# Altium schematic sheet [6] QSPI.SchDoc
size A4
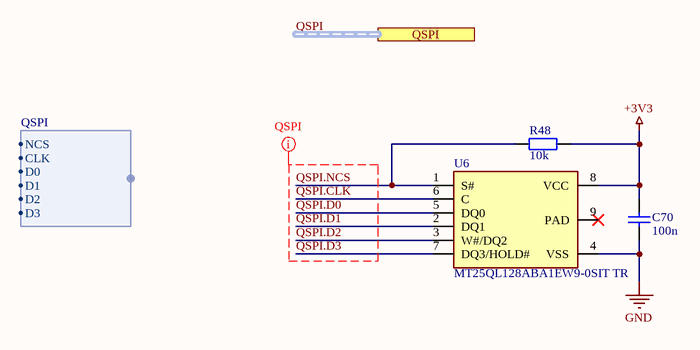
[diagram p0: [6] QSPI.SchDoc]

## Parts
C70  100n  [Capacitor 0603]
R48  10k  [Resistor 0603]
U6  MT25QL128ABA1EW9-0SIT TR  [WDFN8]

## Ports
QSPI (harness QSPI)

## Harnesses
QSPI: CLK, NCS, D0, D2, D3, D1

## Nets
+3V3: C70.2 R48.2 U6.8(VCC)
GND: C70.1 U6.4(VSS)
QSPI.CLK: U6.6(C)
QSPI.D0: U6.5(DQ0)
QSPI.D1: U6.2(DQ1)
QSPI.D2: U6.3(W#/DQ2)
QSPI.D3: U6.7(DQ3/HOLD#)
QSPI.NCS: R48.1 U6.1(S#)

Not connected (* = marked no-connect by the designer): U6 9(PAD)*

## Buses and harness runs
harness QSPI = port QSPI

## Layout directives
net class QSPI: QSPI.CLK, QSPI.D0, QSPI.D1, QSPI.D2, QSPI.D3, QSPI.NCS

## Library data of the parts
C70 = Capacitor 100n 10% 0603 EMK107B7104KA-T: Multilayer Ceramic Capacitors MLCC - SMD/SMT 0603 16VDC 0.1uF 10% X7R; Manufacturer: Taiyo Yuden; Type: SMD; Manufacturer Part Number: EMK107B7104KA-T; Footprint: 0603; Datasheet: https://pl.mouser.com/datasheet/2/396/mlcc02_e-1307760.pdf
R48 = Resistor 10k 1% 0603 RT0603FRE0710KL: Thin Film Resistors - SMD 10K ohm 1% 1/10W; Manufacturer: Yageo; Manufacturer Part Number: RT0603FRE0710KL; Footprint: 0603; Type: SMD; Datasheet: https://pl.mouser.com/datasheet/2/447/PYu_RT_1_to_0_01_RoHS_L_11-1669912.pdf
U6 = IC NOR Flash SPI FLASH NOR SLC 32MX4 WPDFN MT25QL128ABA1EW9-0SIT TR: NOR Flash SPI FLASH NOR SLC 32MX4 WPDFN; Manufacturer: Micron; Manufacturer Part Number: MT25QL128ABA1EW9-0SIT TR; Footprint: WDFN-8; Type: SMD; Datasheet: https://pl.mouser.com/datasheet/2/671/MT25Q_QLHS_L_128_ABA_0-1287003.pdf